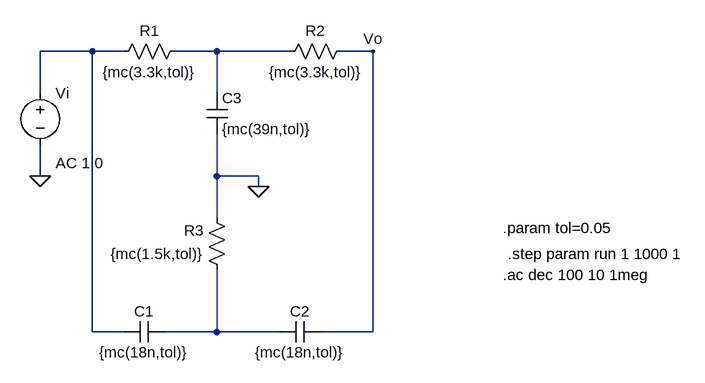
[diagram p0: schematic Monte Carlo.asc]
Monte Carlo.asc, the LTspice schematic file:
Version 4
SHEET 1 968 680
WIRE 32 112 -48 112
WIRE 80 112 32 112
WIRE 224 112 160 112
WIRE 336 112 224 112
WIRE 464 112 416 112
WIRE -48 176 -48 112
WIRE 224 176 224 112
WIRE -48 304 -48 256
WIRE 224 304 224 240
WIRE 288 304 224 304
WIRE 288 320 288 304
WIRE 224 368 224 304
WIRE 32 544 32 112
WIRE 80 544 32 544
WIRE 224 544 224 448
WIRE 224 544 144 544
WIRE 320 544 224 544
WIRE 464 544 464 112
WIRE 464 544 384 544
FLAG -48 304 0
FLAG 288 320 0
FLAG 464 112 Vo
SYMBOL res 176 96 R90
WINDOW 0 0 56 VBottom 2
WINDOW 3 32 56 VTop 2
SYMATTR InstName R1
SYMATTR Value {mc(3.3k,tol)}
SYMBOL res 432 96 R90
WINDOW 0 0 56 VBottom 2
WINDOW 3 32 56 VTop 2
SYMATTR InstName R2
SYMATTR Value {mc(3.3k,tol)}
SYMBOL res 240 464 R180
WINDOW 0 36 76 Left 2
WINDOW 3 36 40 Left 2
SYMATTR InstName R3
SYMATTR Value {mc(1.5k,tol)}
SYMBOL cap 208 176 R0
SYMATTR InstName C3
SYMATTR Value {mc(39n,tol)}
SYMBOL cap 144 528 R90
WINDOW 0 0 32 VBottom 2
WINDOW 3 32 32 VTop 2
SYMATTR InstName C1
SYMATTR Value {mc(18n,tol)}
SYMBOL cap 384 528 R90
WINDOW 0 0 32 VBottom 2
WINDOW 3 32 32 VTop 2
SYMATTR InstName C2
SYMATTR Value {mc(18n,tol)}
SYMBOL voltage -48 160 R0
WINDOW 123 24 124 Left 2
WINDOW 39 0 0 Left 0
SYMATTR Value2 AC 1 0
SYMATTR InstName Vi
SYMATTR Value ""
TEXT 664 456 Left 2 !.ac dec 100 10 1meg
TEXT 664 384 Left 2 !.param tol=0.05
TEXT 672 424 Left 2 !.step param run 1 1000 1

The netlist it stands for:
* Monte Carlo.asc
R1 N002 N001 {mc(3.3k,tol)}
R2 Vo N002 {mc(3.3k,tol)}
R3 N003 0 {mc(1.5k,tol)}
C3 N002 0 {mc(39n,tol)}
C1 N003 N001 {mc(18n,tol)}
C2 Vo N003 {mc(18n,tol)}
Vi N001 0 AC 1 0
.ac dec 100 10 1meg
.param tol=0.05
.step param run 1 1000 1
.backanno
.end